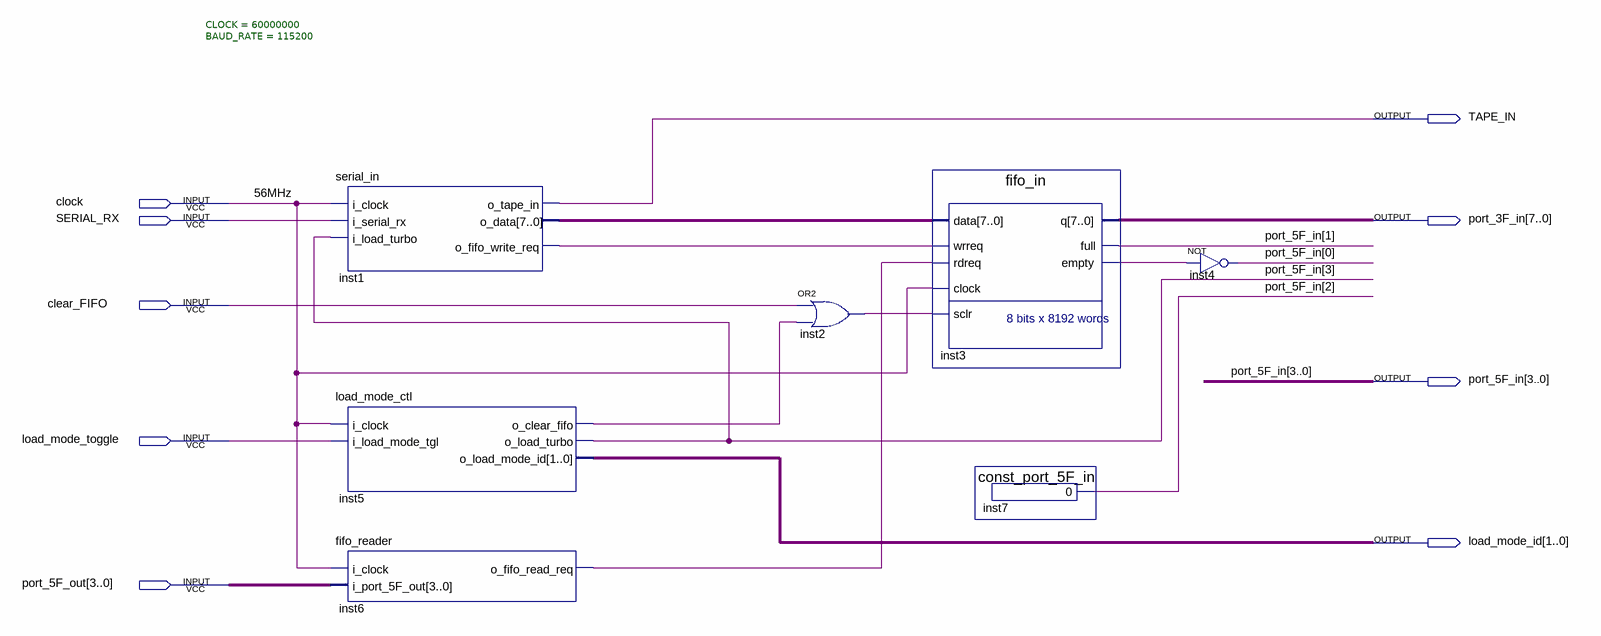
[diagram p0: schematic sheet]
// Quartus schematic tape_reader.bdf as structural Verilog: 7 symbols, 9 pins
module tape_reader (
  input  clock,
  input  SERIAL_RX,
  input  clear_FIFO,
  input  load_mode_toggle,
  input  [3:0] port_5F_out,
  output TAPE_IN,
  output [7:0] port_3F_in,
  output [3:0] port_5F_in,
  output [1:0] load_mode_id
);

  wire inst1_o_fifo_write_req, inst2_out, inst3_empty, inst5_o_clear_fifo, inst6_o_fifo_read_req;
  wire [7:0] inst1_o_data;

  serial_in #(.CLOCK(60000000), .BAUD_RATE(115200)) inst1 (
    .i_clock(clock), .i_serial_rx(SERIAL_RX), .i_load_turbo(port_5F_in[3]), .o_tape_in(TAPE_IN),
    .o_data(inst1_o_data), .o_fifo_write_req(inst1_o_fifo_write_req));
  load_mode_ctl inst5 (
    .i_clock(clock), .i_load_mode_tgl(load_mode_toggle), .o_clear_fifo(inst5_o_clear_fifo),
    .o_load_turbo(port_5F_in[3]), .o_load_mode_id(load_mode_id));
  fifo_reader inst6 (.i_clock(clock), .i_port_5F_out(port_5F_out), .o_fifo_read_req(inst6_o_fifo_read_req));
  or inst2 (inst2_out, clear_FIFO, inst5_o_clear_fifo);
  fifo_in inst3 (
    .data(inst1_o_data), .wrreq(inst1_o_fifo_write_req), .rdreq(inst6_o_fifo_read_req), .clock(clock),
    .sclr(inst2_out), .q(port_3F_in), .full(port_5F_in[1]), .empty(inst3_empty));
  const_port_5F_in inst7 (.result(port_5F_in[2]));
  not inst4 (port_5F_in[0], inst3_empty);

  // Other names for the same wires on the sheet: 56MHz = clock
endmodule
